# Altium project TemperatureController_2Outputs_v2.0.PrjPcb
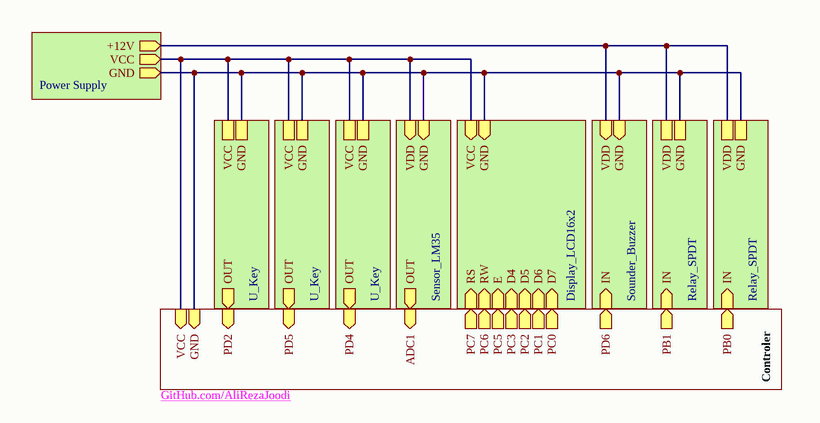
[diagram p0: Main.SchDoc]
14 sheets, 48 parts. Net scope: hierarchical (ports join the sheet entries above them; power ports are global).
Board file: Main.PcbDoc
Sheets:
  Main.SchDoc
    Controler = Controler.SchDoc
      ATmega16 = MCU_ATmega16_DIP.SchDoc
      U_Key = Key_Pull-Up.SchDoc
      U_Oscillator_11 = Oscillator_11.059200MHz.SchDoc
      U_Programer Connectors_SPI = Programer Connectors_SPI.SchDoc
    Display_LCD16x2 = Display_LCD16x2.SchDoc
    Sounder_Buzzer = Sounder_Buzzer.SchDoc
    U_Sensor_LM35 = Sensor_LM35.SchDoc
    U_Power Supply = Power Supply.SchDoc
      U_Power Supply_78xx = Voltage_Regulators_78xx_Figure 1.SchDoc
      U_Power Supply_78xx = Voltage_Regulators_78xx_Figure 1.SchDoc
      U_Voltage_Bridge = Voltage_Bridge.SchDoc
      U_Display_LED_Anode Command = Display_LED_Anode Command.SchDoc
    U_Relay_SPDT = Relay_SPDT.SchDoc
    U_Relay_SPDT = Relay_SPDT.SchDoc
    U_Key = Key_Pull-Up.SchDoc
    U_Key = Key_Pull-Up.SchDoc
    U_Key = Key_Pull-Up.SchDoc

## Sheet Main.SchDoc: Bluetooth Sentinel
size 152 x 76 mm

### Sub-sheets
Controler = Controler.SchDoc: VCC (in), GND (in), PD2 (in), PD5 (in), PD4 (in), PC7 (out), PC6 (out), PC5 (out), PC3 (out), PC2 (out), PC1 (out), PC0 (out), PD6 (out), PB0 (out), PB1 (out), ADC1 (in)
Display_LCD16x2 = Display_LCD16x2: D7 (in), D6 (in), D5 (in), D4 (in), E (in), RW (in), RS (in), GND (in), VCC (in)
Sounder_Buzzer = Sounder_Buzzer: IN (in), GND (in), VDD (in)
U_Key = Key_Pull-Up: OUT (out), GND, VCC
U_Key = Key_Pull-Up: OUT (out), GND, VCC
U_Key = Key_Pull-Up: OUT (out), GND, VCC
U_Power Supply = Power Supply: VCC (out), GND (out), +12V (out)
U_Relay_SPDT = Relay_SPDT: IN (in), GND, VDD
U_Relay_SPDT = Relay_SPDT: IN (in), GND, VDD
U_Sensor_LM35 = Sensor_LM35: VDD (in), OUT (out), GND (in)

### Nets
GND: sheet Controler/GND, sheet Display_LCD16x2/GND, sheet Sounder_Buzzer/GND, sheet U_Sensor_LM35/GND, sheet U_Power Supply/GND, sheet U_Relay_SPDT/GND, sheet U_Relay_SPDT/GND, sheet U_Key/GND, sheet U_Key/GND, sheet U_Key/GND
VCC: sheet Controler/VCC, sheet Display_LCD16x2/VCC, sheet U_Sensor_LM35/VDD, sheet U_Power Supply/VCC, sheet U_Key/VCC, sheet U_Key/VCC, sheet U_Key/VCC
VDD: sheet Sounder_Buzzer/VDD, sheet U_Power Supply/+12V, sheet U_Relay_SPDT/VDD, sheet U_Relay_SPDT/VDD
NetC6_1: sheet Controler/ADC1, sheet U_Sensor_LM35/OUT
NetLCD1_4: sheet Controler/PC7, sheet Display_LCD16x2/RS
NetLCD1_5: sheet Controler/PC6, sheet Display_LCD16x2/RW
NetLCD1_6: sheet Controler/PC5, sheet Display_LCD16x2/E
NetLCD1_11: sheet Controler/PC3, sheet Display_LCD16x2/D4
NetLCD1_12: sheet Controler/PC2, sheet Display_LCD16x2/D5
NetLCD1_13: sheet Controler/PC1, sheet Display_LCD16x2/D6
NetLCD1_14: sheet Controler/PC0, sheet Display_LCD16x2/D7
NetR5_U_Key2_2: sheet Controler/PD2, sheet U_Key/OUT
NetR5_U_Key3_2: sheet Controler/PD5, sheet U_Key/OUT
NetR5_U_Key4_2: sheet Controler/PD4, sheet U_Key/OUT
NetR7_U_Relay_SPDT1_2: sheet Controler/PB1, sheet U_Relay_SPDT/IN
NetR7_U_Relay_SPDT2_2: sheet Controler/PB0, sheet U_Relay_SPDT/IN
NetR8_1: sheet Controler/PD6, sheet Sounder_Buzzer/IN

### Notes on the sheet
- GitHub.com/AliRezaJoodi
- Sheet Title
- Project Title
- Size:
- Date:
- A4
- Item:
- Time:
- Revision:
- Sheet
- of
- File:

## Sheet Controler.SchDoc: Microcontroller STM32F101
size 111 x 101 mm
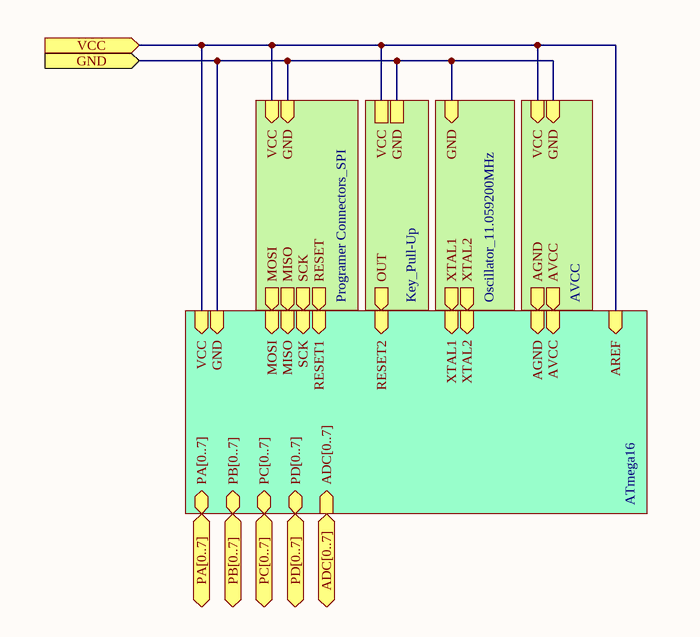
[diagram p1: Controler.SchDoc]

### Sub-sheets
ATmega16 = MCU_ATmega16_DIP.SchDoc: XTAL1 (in), XTAL2 (in), MOSI (in), MISO (in), SCK (in), RESET1 (in), PA[0..7] (bidir), VCC (in), GND (in), PB[0..7], PC[0..7] (bidir), PD[0..7], RESET2 (in), AVCC (in), AREF (in), AGND (in), ADC[0..7] (in)
U_AVCC = AVCC (file not in this document): VCC (in), GND (in), AVCC (out), AGND (out)
U_Key = Key_Pull-Up: OUT (out), GND, VCC
U_Oscillator_11 = Oscillator_11.059200MHz: XTAL1 (out), XTAL2 (out), GND (in)
U_Programer Connectors_SPI = Programer Connectors_SPI: RESET (out), MOSI (out), MISO (out), SCK (out), GND (in), VCC (in)

### Ports
ADC[0..7] (in), GND (in), PA[0..7] (bidir), PB[0..7] (bidir), PC[0..7] (bidir), PD[0..7] (bidir), VCC (in)

### Nets
GND: port GND, sheet ATmega16/GND, sheet U_Key/GND, sheet U_Oscillator_11/GND, sheet U_AVCC/GND, sheet U_Programer Connectors_SPI/GND
VCC: port VCC, sheet ATmega16/VCC, sheet ATmega16/AREF, sheet U_Key/VCC, sheet U_AVCC/VCC, sheet U_Programer Connectors_SPI/VCC
NetC1_2: sheet ATmega16/XTAL1, sheet U_Oscillator_11/XTAL1
NetC2_2: sheet ATmega16/XTAL2, sheet U_Oscillator_11/XTAL2
NetJ1_1: sheet ATmega16/MOSI, sheet U_Programer Connectors_SPI/MOSI
NetJ1_2: sheet ATmega16/MISO, sheet U_Programer Connectors_SPI/MISO
NetJ1_3: sheet ATmega16/SCK, sheet U_Programer Connectors_SPI/SCK
NetJ1_4: sheet ATmega16/RESET1, sheet ATmega16/RESET2, sheet U_Key/OUT, sheet U_Programer Connectors_SPI/RESET
NetU1_30: sheet ATmega16/AVCC, sheet U_AVCC/AVCC
NetU1_31: sheet ATmega16/AGND, sheet U_AVCC/AGND

### Buses and harness runs
bus port ADC[0..7] = sheet ATmega16/ADC[0..7]
bus port PA[0..7] = sheet ATmega16/PA[0..7]
bus port PB[0..7] = sheet ATmega16/PB[0..7]
bus port PC[0..7] = sheet ATmega16/PC[0..7]
bus port PD[0..7] = sheet ATmega16/PD[0..7]

### Notes on the sheet
- Sheet Title
- Project Title
- Size:
- Date:
- A4
- Item:
- Time:
- Revision:
- Sheet
- of
- File:

## Sheet MCU_ATmega16_DIP.SchDoc
size 127 x 88 mm
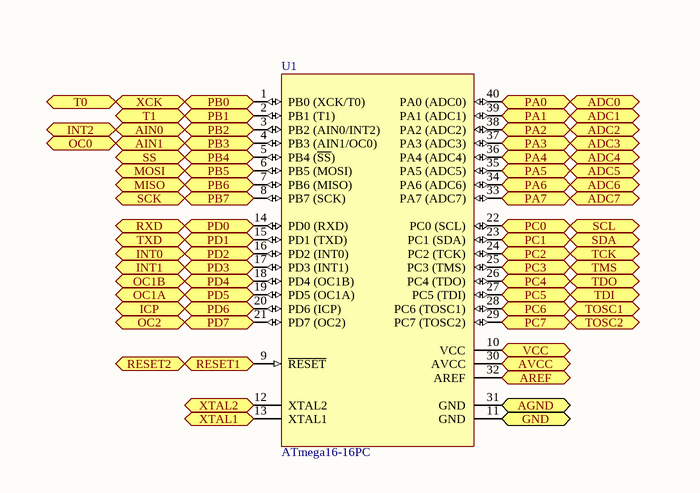
[diagram p2: MCU_ATmega16_DIP.SchDoc]

### Parts
U1  ATmega16-16PC  [40P6]

### Ports
ADC0 (bidir), ADC1 (bidir), ADC2 (bidir), ADC3 (bidir), ADC4 (bidir), ADC5 (bidir), ADC6 (bidir), ADC7 (bidir), AGND, AIN0 (bidir), AIN1 (bidir), AREF, AVCC, GND, ICP (bidir), INT0 (bidir), INT1 (bidir), INT2 (bidir), MISO (bidir), MOSI (bidir), OC0 (bidir), OC1A (bidir), OC1B (bidir), OC2 (bidir), PA0 (bidir), PA1 (bidir), PA2 (bidir), PA3 (bidir), PA4 (bidir), PA5 (bidir), PA6 (bidir), PA7 (bidir), PB0, PB1, PB2, PB3, PB4, PB5, PB6, PB7, PC0 (bidir), PC1 (bidir), PC2 (bidir), PC3 (bidir), PC4 (bidir), PC5 (bidir), PC6 (bidir), PC7 (bidir), PD0, PD1, PD2, PD3, PD4, PD5, PD6, PD7, RESET1 (in), RESET2 (in), RXD (bidir), SCK (bidir), SCL (bidir), SDA (bidir), SS (bidir), T0 (bidir), T1 (bidir), TCK (bidir), TDI (bidir), TDO (bidir), TMS (bidir), TOSC1 (bidir), TOSC2 (bidir), TXD (bidir), VCC, XCK (bidir), XTAL1 (bidir), XTAL2 (bidir)

### Nets
GND: U1.11(GND) ; port GND
VCC: U1.10(VCC) U1.32(AREF) ; port VCC, port AREF
NetC1_2: U1.13(XTAL1) ; port XTAL1
NetC2_2: U1.12(XTAL2) ; port XTAL2
NetJ1_1: U1.6(PB5_(MOSI)) ; port PB5, port MOSI
NetJ1_2: U1.7(PB6_(MISO)) ; port MISO, port PB6
NetJ1_3: U1.8(PB7_(SCK)) ; port SCK, port PB7
NetJ1_4: U1.9(~{RESET}) ; port RESET1, port RESET2
NetU1_1: U1.1(PB0_(XCK/T0)) ; port XCK, port PB0, port T0
NetU1_2: U1.2(PB1_(T1)) ; port T1, port PB1
NetU1_3: U1.3(PB2_(AIN0/INT2)) ; port PB2, port AIN0, port INT2
NetU1_4: U1.4(PB3_(AIN1/OC0)) ; port AIN1, port PB3, port OC0
NetU1_5: U1.5(PB4_(~{SS})) ; port SS, port PB4
NetU1_14: U1.14(PD0_(RXD)) ; port RXD, port PD0
NetU1_15: U1.15(PD1_(TXD)) ; port TXD, port PD1
NetU1_16: U1.16(PD2_(INT0)) ; port PD2, port INT0
NetU1_17: U1.17(PD3_(INT1)) ; port INT1, port PD3
NetU1_18: U1.18(PD4_(OC1B)) ; port OC1B, port PD4
NetU1_19: U1.19(PD5_(OC1A)) ; port PD5, port OC1A
NetU1_20: U1.20(PD6_(ICP)) ; port ICP, port PD6
NetU1_21: U1.21(PD7_(OC2)) ; port OC2, port PD7
NetU1_22: U1.22(PC0_(SCL)) ; port PC0, port SCL
NetU1_23: U1.23(PC1_(SDA)) ; port PC1, port SDA
NetU1_24: U1.24(PC2_(TCK)) ; port PC2, port TCK
NetU1_25: U1.25(PC3_(TMS)) ; port PC3, port TMS
NetU1_26: U1.26(PC4_(TDO)) ; port PC4, port TDO
NetU1_27: U1.27(PC5_(TDI)) ; port PC5, port TDI
NetU1_28: U1.28(PC6_(TOSC1)) ; port PC6, port TOSC1
NetU1_29: U1.29(PC7_(TOSC2)) ; port PC7, port TOSC2
NetU1_30: U1.30(AVCC) ; port AVCC
NetU1_31: U1.31(GND) ; port AGND
NetU1_33: U1.33(PA7_(ADC7)) ; port PA7, port ADC7
NetU1_34: U1.34(PA6_(ADC6)) ; port PA6, port ADC6
NetU1_35: U1.35(PA5_(ADC5)) ; port PA5, port ADC5
NetU1_36: U1.36(PA4_(ADC4)) ; port PA4, port ADC4
NetU1_37: U1.37(PA3_(ADC3)) ; port PA3, port ADC3
NetU1_38: U1.38(PA2_(ADC2)) ; port PA2, port ADC2
NetU1_39: U1.39(PA1_(ADC1)) ; port PA1, port ADC1
NetU1_40: U1.40(PA0_(ADC0)) ; port PA0, port ADC0

### Library data of the parts
U1 = ATmega16-16PC: 8-Bit AVR Microcontroller with 16K Bytes of In-System Programmable Flash Memory; Published: 17-Sep-2003; DatasheetVersion: 2466E-AVR-10/02; PackageVersion: revB, Sep-2001; PackageReference: 40P6; Publisher: Altium Limited; PackageDescription: 40-lead (0.600"/15.24mm Wide) Plastic Dual Inline Package (PDIP); Supplier 1: Digi-Key; Supplier Part Number 1: ATMEGA16-16PC-ND; Supplier 2: Mouser; Supplier Part Number 2: 556-ATMEGA16-16PC; Code_JEDEC: MS-011-AC; ComponentLink1Description: Datasheet; ComponentLink1URL: http://www.atmel.com/dyn/resources/prod_documents/doc2466.pdf; ComponentLink2Description: Atmel.com Home; ComponentLink2URL: http://www.atmel.com

## Sheet Key_Pull-Up.SchDoc
size 76 x 55 mm
Used 4 times, as channels Controler/U_Key, U_Key, U_Key, U_Key. Parts and nets are listed once, with the designators drawn on the sheet.
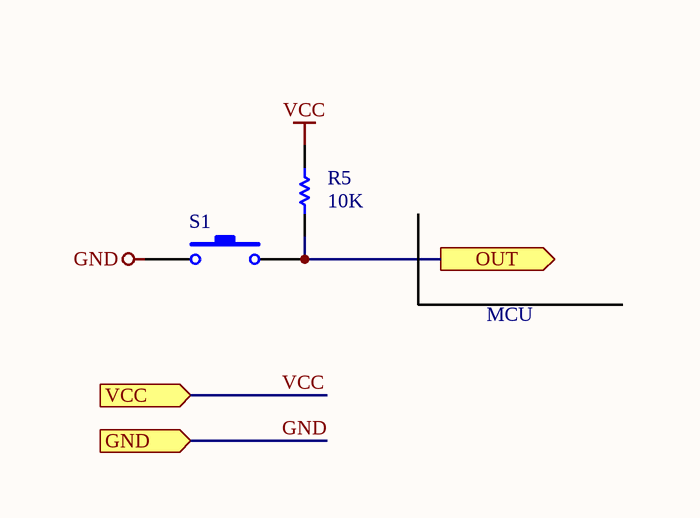
[diagram p3: Key_Pull-Up.SchDoc]

### Parts
R5  value 10K  [AXIAL-0.4]  (hidden comment: Res1)
S1  SW-PB  [SPST-2_2]  (value not drawn)

### Ports
GND, OUT (out), VCC

### Nets
GND: S1.1 ; port GND
VCC: R5.1 ; port VCC
OUT: R5.2 S1.2 ; port OUT

### Channels
Controler/U_Key: designators end in _U_Key1; ports GND=GND OUT=NetJ1_4 VCC=VCC
U_Key: designators end in _U_Key2; ports GND=GND OUT=NetR5_U_Key2_2 VCC=VCC
U_Key: designators end in _U_Key3; ports GND=GND OUT=NetR5_U_Key3_2 VCC=VCC
U_Key: designators end in _U_Key4; ports GND=GND OUT=NetR5_U_Key4_2 VCC=VCC

### Notes on the sheet
- MCU

### Library data of the parts
R5 = Res1: Resistor; Manufacturer: Generic Components; Class I: Passive; Published: 8-Jun-2000; Revision: July-2002: Re-released for DXP Platform.; Publisher: Altium Limited; Class II: Resistor
S1 = SW-PB: Switch; Manufacturer: Generic Components; Published: 24-Mar-1999; Revision: July-2002: Re-released for DXP Platform.; Publisher: Altium Limited

## Sheet Oscillator_11.059200MHz.SchDoc
size 81 x 45 mm
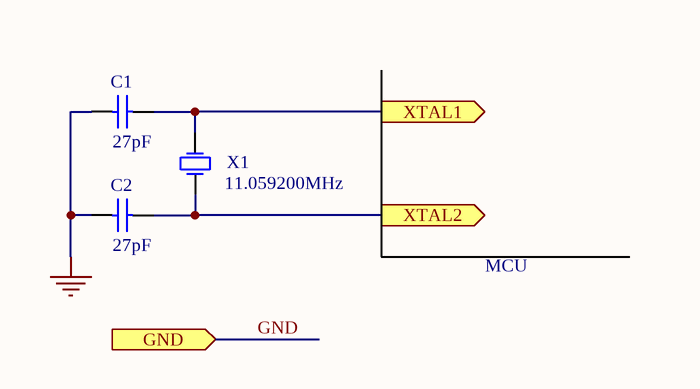
[diagram p4: Oscillator_11.059200MHz.SchDoc]

### Parts
C1  value 27pF  [CAPNTO2.54-3.56x2.03]  (hidden comment: Cap)
C2  value 27pF  [CAPNTO2.54-3.56x2.03]  (hidden comment: Cap)
X1  value 11.059200MHz  [XTAL_1]  (hidden comment: XTAL)

### Ports
GND (in), XTAL1 (out), XTAL2 (out)

### Nets
GND: C1.1 C2.1 ; port GND
NetC1_2: C1.2 X1.2(OSC2) ; port XTAL1
NetC2_2: C2.2 X1.1(OSC1) ; port XTAL2

### Notes on the sheet
- MCU

### Library data of the parts
C1 C2 = Cap: Capacitor; Manufacturer: Generic Components; Class I: Passive; Published: 8-Jun-2000; Revision: July-2002: Re-released for DXP Platform.; Publisher: Altium Limited; Class II: Capacitor
X1 = XTAL: Crystal Oscillator; Manufacturer: Generic Components; Published: 8-Jun-2000; Revision: July-2002: Re-released for DXP Platform.; Publisher: Altium Limited; Class I: Oscillator; Class II: Crystal Oscillator

## Sheet Programer Connectors_SPI.SchDoc
size 50 x 30 mm
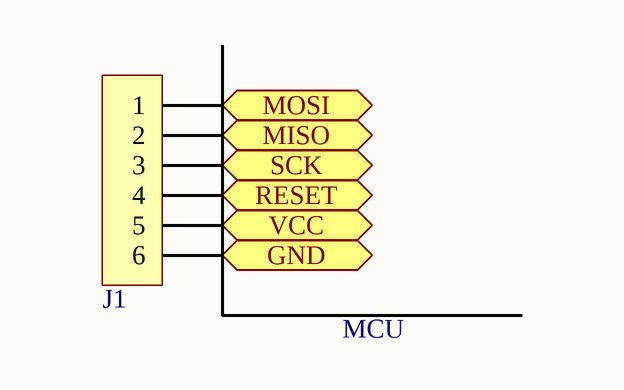
[diagram p5: Programer Connectors_SPI.SchDoc]

### Parts
J1  Connector_6pin  [HDR1X6]  (value not drawn)

### Ports
GND (in), MISO (out), MOSI (out), RESET (out), SCK (out), VCC (in)

### Nets
GND: J1.6 ; port GND
VCC: J1.5 ; port VCC
NetJ1_1: J1.1 ; port MOSI
NetJ1_2: J1.2 ; port MISO
NetJ1_3: J1.3 ; port SCK
NetJ1_4: J1.4 ; port RESET

### Notes on the sheet
- MCU

### Library data of the parts
J1 = Connector_6pin: Header, 6-Pin; Manufacturer: Generic Components; Revision: July-2002: Re-released for DXP Platform.; Publisher: Altium Limited; Class I: Connector

## Sheet Display_LCD16x2.SchDoc
size 116 x 109 mm
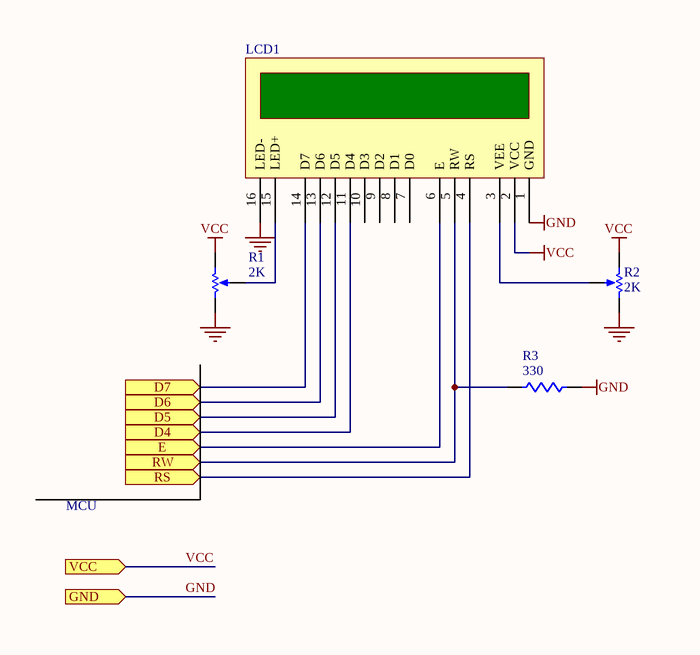
[diagram p6: Display_LCD16x2.SchDoc]

### Parts
LCD1  LCD_16*2  [LCD_2x16]  (value not drawn)
R1  value 2K  [VR8-5/5.6MM]  (hidden comment: RPot1)
R2  value 2K  [VR8-5/5.6MM]  (hidden comment: RPot1)
R3  value 330  [AXIAL-0.4]  (hidden comment: Res1)

### Ports
D4 (in), D5 (in), D6 (in), D7 (in), E (in), GND, RS (in), RW (in), VCC

### Nets
GND: LCD1.1(GND) LCD1.16(LED-) R1.2(BOT) R2.1(TOP) R3.1 ; port GND
VCC: LCD1.2(VCC) R1.1(TOP) R2.2(BOT) ; port VCC
NetLCD1_3: LCD1.3(VEE) R2.3(TAP)
NetLCD1_4: LCD1.4(RS) ; port RS
NetLCD1_5: LCD1.5(RW) R3.2 ; port RW
NetLCD1_6: LCD1.6(E) ; port E
NetLCD1_11: LCD1.11(D4) ; port D4
NetLCD1_12: LCD1.12(D5) ; port D5
NetLCD1_13: LCD1.13(D6) ; port D6
NetLCD1_14: LCD1.14(D7) ; port D7
NetLCD1_15: LCD1.15(LED+) R1.3(TAP)

Not connected (* = marked no-connect by the designer): LCD1 7(D0) 8(D1) 9(D2) 10(D3)

### Notes on the sheet
- MCU

### Library data of the parts
R1 R2 = RPot1: Potentiometer; Manufacturer: Generic Components; Class I: Passive; Set Position: 0.5; Published: 8-Jun-2000; Revision: July-2002: Re-released for DXP Platform.; Publisher: Altium Limited; Class II: Potentiometer
R3 = Res1: as R5 on sheet Key_Pull-Up; Published: 8-Jun-2000; Revision: July-2002: Re-released for DXP Platform.; Publisher: Altium Limited; Class II: Resistor

## Sheet Sounder_Buzzer.SchDoc
size 87 x 67 mm
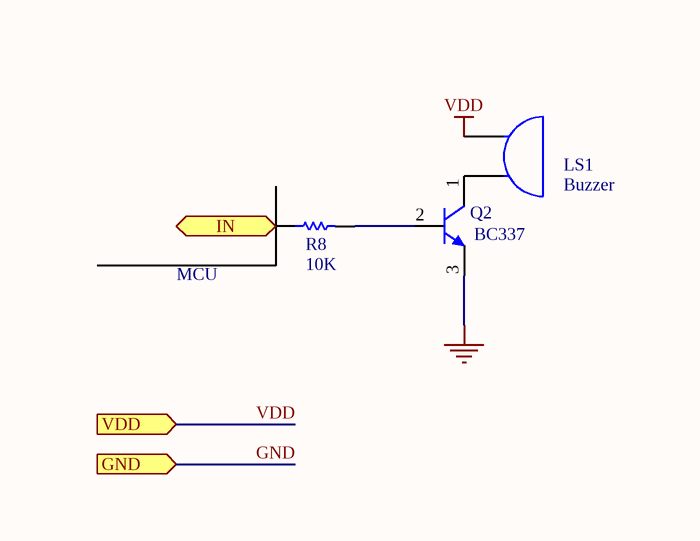
[diagram p7: Sounder_Buzzer.SchDoc]

### Parts
LS1  Buzzer  [BUZZER]
Q2  value BC337  [TO92C]  (hidden comment: NPN)
R8  value 10K  [AXIAL-0.4]  (hidden comment: Res1)

### Ports
GND, IN (in), VDD

### Nets
GND: Q2.3(E) ; port GND
VDD: LS1.1(A) ; port VDD
NetLS1_2: LS1.2(B) Q2.1(C)
NetQ2_2: Q2.2(B) R8.2
NetR8_1: R8.1 ; port IN

### Notes on the sheet
- MCU

### Library data of the parts
LS1 = Buzzer: Manufacturer: Generic Components; Published: 24-Mar-1999; Revision: July-2002: Re-released for DXP Platform.; Publisher: Altium Limited
Q2 = NPN: NPN Bipolar Transistor; Manufacturer: Generic Components; Class I: Discrete; Class II: BJT - Low Power; Published: 8-Jun-2000; Revision: July-2002: Re-released for DXP Platform.; Publisher: Altium Limited
R8 = Res1: as R5 on sheet Key_Pull-Up; Published: 8-Jun-2000; Revision: July-2002: Re-released for DXP Platform.; Publisher: Altium Limited; Class II: Resistor

## Sheet Sensor_LM35.SchDoc
size 101 x 45 mm
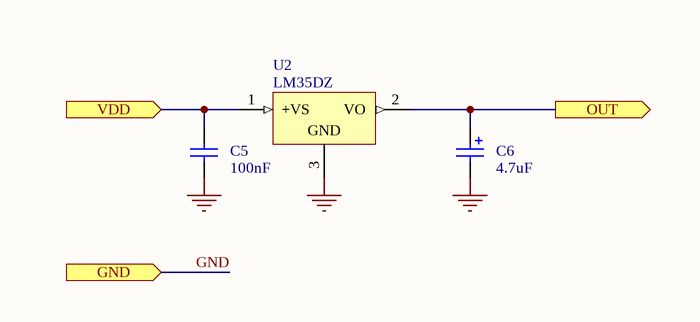
[diagram p8: Sensor_LM35.SchDoc]

### Parts
C5  value 100nF  [CAPNTO5.08-7.37x3.94]  (hidden comment: Cap)
C6  value 4.7uF  [CAPPR2.5-6.3x5]  (hidden comment: Cap Pol1)
U2  LM35DZ  [TO92C]

### Ports
GND (in), OUT (out), VDD (in)

### Nets
GND: C5.1 C6.2 U2.3(GND) ; port GND
VCC: C5.2 U2.1(+VS) ; port VDD
NetC6_1: C6.1 U2.2(VO) ; port OUT

### Library data of the parts
C5 = Cap: as C1 on sheet Oscillator_11.059200MHz; Published: 8-Jun-2000; Revision: July-2002: Re-released for DXP Platform.; Publisher: Altium Limited; Class II: Capacitor
C6 = Cap Pol1: Polarized Capacitor (Radial); Manufacturer: Generic Components; Class I: Passive; Published: 8-Jun-2000; Revision: July-2002: Re-released for DXP Platform.; Publisher: Altium Limited; Class II: Capacitor
U2 = LM35DZ: Precision Centigrade Temperature Sensor, 3-pin TO-92; Manufacturer: National Semiconductor; PackageTopMarking: NSXYTT*LM35*DZ; PowerWise: N; CompType: Temp Sensor IC; Published: 4-Dec-2008; LatestRevisionDate: 15-Jul-2009; LatestRevisionNote: Sch pins 1 & 3 reversed.; DatasheetVersion: Nov-2000; PackageVersion: revG, Sep-2000; PackageReference: Z03A; Publisher: Altium Limited; PackageDescription: TO-92, Molded, 3 Lead; Supplier 1: Farnell; Supplier Part Number 1: 9488200; PartNumber: LM35DZ; RoHS: N; PinCount: 3; Code_JEDEC: TO-226-AA; ComponentLink1Description: LM35 Datasheet; ComponentLink1URL: http://www.national.com/ds/LM/LM35.pdf; ComponentLink2Description: LM35 Web Page; ComponentLink2URL: http://www.national.com/pf/LM/LM35.html; ComponentLink3Description: Z03A Package Page; ComponentLink3URL: http://www.national.com/packaging/folders/z03a.html

## Sheet Power Supply.SchDoc
size 152 x 39 mm
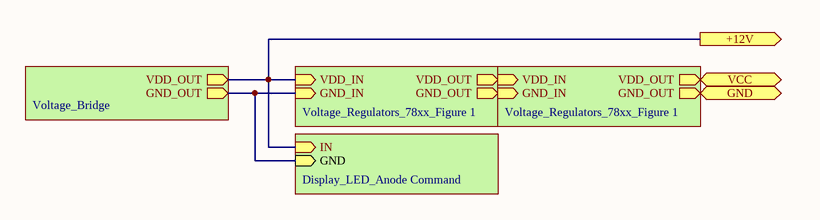
[diagram p9: Power Supply.SchDoc]

### Sub-sheets
U_Display_LED_Anode Command = Display_LED_Anode Command: GND (in), IN (in)
U_Power Supply_78xx = Voltage_Regulators_78xx_Figure 1: VDD_OUT (out), GND_IN (in), VDD_IN (in), GND_OUT (out)
U_Power Supply_78xx = Voltage_Regulators_78xx_Figure 1: VDD_OUT (out), GND_IN (in), VDD_IN (in), GND_OUT (out)
U_Voltage_Bridge = Voltage_Bridge: VDD_OUT (out), GND_OUT (out)

### Ports
+12V (out), GND (out), VCC (out)

### Nets
GND: port GND, sheet U_Power Supply_78xx/GND_IN, sheet U_Power Supply_78xx/GND_OUT, sheet U_Power Supply_78xx/GND_IN, sheet U_Power Supply_78xx/GND_OUT, sheet U_Voltage_Bridge/GND_OUT, sheet U_Display_LED_Anode Command/GND
VCC: port VCC, sheet U_Power Supply_78xx/VDD_OUT
VDD: port +12V, sheet U_Power Supply_78xx/VDD_IN, sheet U_Voltage_Bridge/VDD_OUT, sheet U_Display_LED_Anode Command/IN
NetC3_U_Power_Supply_78xx1_1: sheet U_Power Supply_78xx/VDD_OUT, sheet U_Power Supply_78xx/VDD_IN

## Sheet Voltage_Regulators_78xx_Figure 1.SchDoc
size 96 x 43 mm
Used 2 times, as channels U_Power Supply/U_Power Supply_78xx, U_Power Supply/U_Power Supply_78xx. Parts and nets are listed once, with the designators drawn on the sheet.
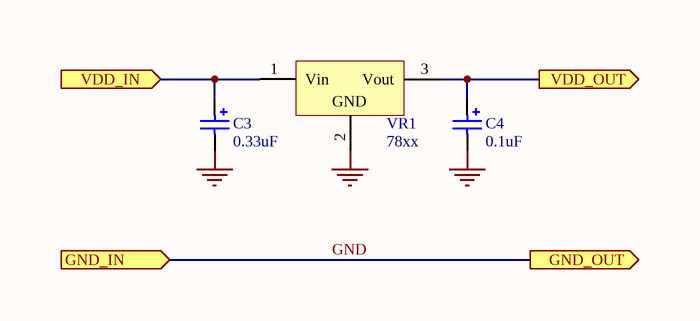
[diagram p10: Voltage_Regulators_78xx_Figure 1.SchDoc]

### Parts
C3  value 0.33uF  [CAPPR2.5-6.3x5]  (hidden comment: Cap Pol1)
C4  value 0.1uF  [CAPPR2.5-6.3x5]  (hidden comment: Cap Pol1)
VR1  value 78xx  [TO257H]  (hidden comment: Volt Reg)

### Ports
GND_IN (in), GND_OUT (out), VDD_IN (in), VDD_OUT (out)

### Nets
GND: C3.2 C4.2 VR1.2(GND) ; port GND_IN, port GND_OUT
VDD_IN: C3.1 VR1.1(Vin) ; port VDD_IN
VDD_OUT: C4.1 VR1.3(Vout) ; port VDD_OUT

### Channels
U_Power Supply/U_Power Supply_78xx: designators end in _U_Power_Supply_78xx2; ports GND_IN=GND GND_OUT=GND VDD_IN=VDD VDD_OUT=NetC3_U_Power_Supply_78xx1_1
U_Power Supply/U_Power Supply_78xx: designators end in _U_Power_Supply_78xx1; ports GND_IN=GND GND_OUT=GND VDD_IN=NetC3_U_Power_Supply_78xx1_1 VDD_OUT=VCC

### Library data of the parts
C3 C4 = Cap Pol1: as C6 on sheet Sensor_LM35; Published: 8-Jun-2000; Revision: July-2002: Re-released for DXP Platform.; Publisher: Altium Limited; Class II: Capacitor
VR1 = Volt Reg: Voltage Regulator; Manufacturer: Generic Components; Class I: Power Management; Published: 24-Mar-1999; Revision: July-2002: Re-released for DXP Platform.; Publisher: Altium Limited; Class II: Voltage Regulator

## Sheet Voltage_Bridge.SchDoc
size 99 x 48 mm
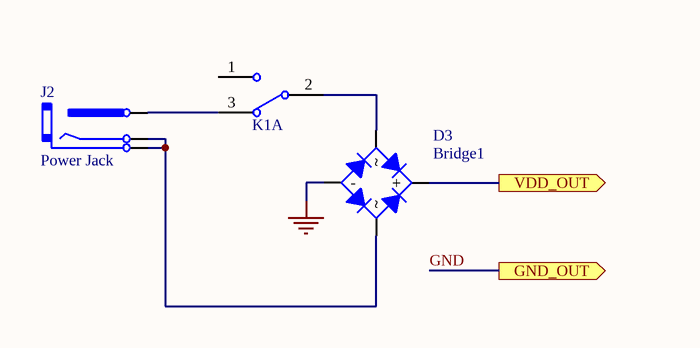
[diagram p11: Voltage_Bridge.SchDoc]

### Parts
D3  Bridge1  [BRIDGE-2]
J2  Power Jack  [KLD-0202]
K1  SW DPDT_2  [DPDT-6_2]  (value not drawn)  (part A of 2)

### Ports
GND_OUT (out), VDD_OUT (out)

### Nets
GND: D3.1(-) ; port GND_OUT
VDD: D3.3(+) ; port VDD_OUT
NetD3_2: D3.2 K1.2(COMMON)
NetD3_4: D3.4 J2.2(A) J2.3(B)
NetJ2_1: J2.1(A) K1.3(NC)

Not connected (* = marked no-connect by the designer): K1 1(NO)

### Library data of the parts
D3 = Bridge1: Full Wave Diode Bridge; Manufacturer: Generic Components; Class I: Discrete; Class II: Rectifier - Bridge; Published: 8-Jun-2000; Revision: July-2002: Re-released for DXP Platform.; Publisher: Altium Limited
K1 = SW DPDT_2: Single-Pole, Double-Throw Switch, Key; Manufacturer: Generic Components; Published: 24-Mar-1999; Revision: July-2002: Re-released for DXP Platform.; Publisher: Altium Limited

## Sheet Display_LED_Anode Command.SchDoc: Red LED
size 60 x 33 mm
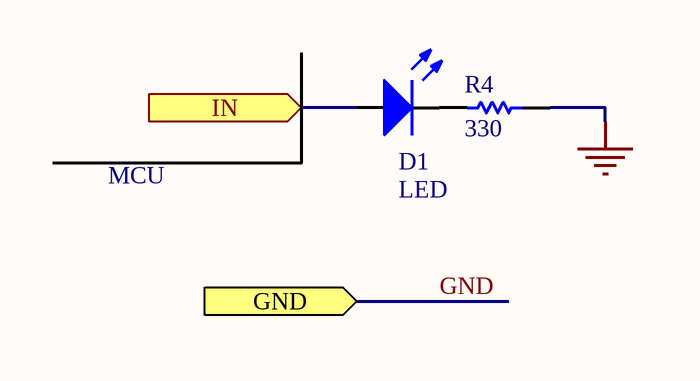
[diagram p12: Display_LED_Anode Command.SchDoc]

### Parts
D1  LED  [LED-5mm_Red]
R4  value 330  [AXIAL-0.4]  (hidden comment: Res1)

### Ports
GND (in), IN (in)

### Nets
GND: R4.1 ; port GND
VDD: D1.1(A) ; port IN
NetD1_2: D1.2(K) R4.2

### Notes on the sheet
- MCU
- Sheet Title
- Project Title
- Size:
- Date:
- A4
- Item:
- Time:
- Revision:
- Sheet
- of
- File:

### Library data of the parts
D1 = LED: Typical INFRARED GaAs LED; Manufacturer: Generic Components; Class I: Optoelectronic; Published: 8-Jun-2000; Revision: July-2002: Re-released for DXP Platform.; Publisher: Altium Limited; Class II: LED
R4 = Res1: as R5 on sheet Key_Pull-Up; Published: 8-Jun-2000; Revision: July-2002: Re-released for DXP Platform.; Publisher: Altium Limited; Class II: Resistor

## Sheet Relay_SPDT.SchDoc
size 106 x 88 mm
Used 2 times, as channels U_Relay_SPDT, U_Relay_SPDT. Parts and nets are listed once, with the designators drawn on the sheet.
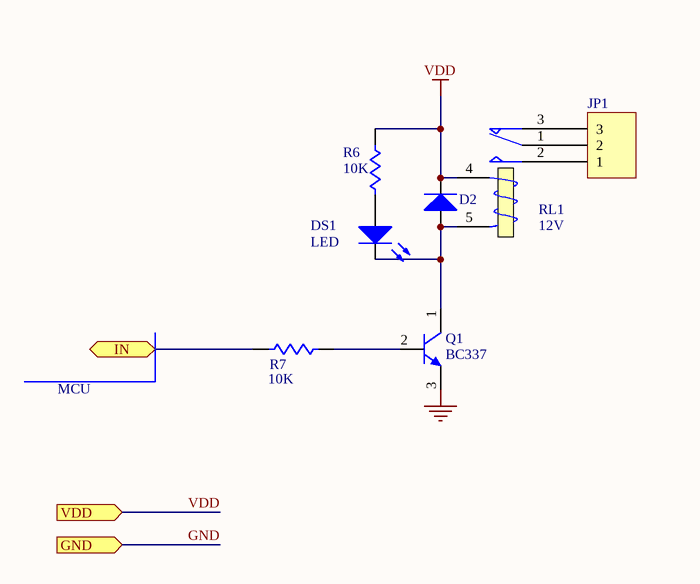
[diagram p13: Relay_SPDT.SchDoc]

### Parts
D2  Diode  [DIODE-0.4]  (value not drawn)
DS1  LED  [LED-5mm_Red]
JP1  Header 3  [Fonics_3C]  (value not drawn)
Q1  BC337  [TO92C]
R6  value 10K  [AXIAL-0.4]  (hidden comment: Res1)
R7  value 10K  [AXIAL-0.4]  (hidden comment: Res1)
RL1  value 12V  [RELAY-SPDT-1]  (hidden comment: Relay-SPDT_2)

### Ports
GND, IN, VDD

### Nets
GND: Q1.3(E) ; port GND
VDD: D2.2(K) R6.1 RL1.4(T1) ; port VDD
IN: R7.2 ; port IN
NetD2_1: D2.1(A) DS1.2(K) Q1.1(C) RL1.5(T2)
NetDS1_1: DS1.1(A) R6.2
NetJP1_1: JP1.1 RL1.2(NO)
NetJP1_2: JP1.2 RL1.1(COM)
NetJP1_3: JP1.3 RL1.3(NC)
NetQ1_2: Q1.2(B) R7.1

### Channels
U_Relay_SPDT: designators end in _U_Relay_SPDT1; ports GND=GND IN=NetR7_U_Relay_SPDT1_2 VDD=VDD
U_Relay_SPDT: designators end in _U_Relay_SPDT2; ports GND=GND IN=NetR7_U_Relay_SPDT2_2 VDD=VDD

### Notes on the sheet
- MCU

### Library data of the parts
D2 = Diode: Default Diode; Manufacturer: Generic Components; Class I: Discrete; Class II: Diode - Switching; Published: 8-Jun-2000; Revision: July-2002: Re-released for DXP Platform.; Publisher: Altium Limited
DS1 = LED: as D1 on sheet Display_LED_Anode Command; Published: 8-Jun-2000; Revision: July-2002: Re-released for DXP Platform.; Publisher: Altium Limited; Class II: LED
JP1 = Header 3: Header, 3-Pin; Manufacturer: Generic Components; Class I: Connector; Revision: July-2002: Re-released for DXP Platform.; Publisher: Altium Limited
Q1 = NPN: as Q2 on sheet Sounder_Buzzer; Published: 8-Jun-2000; Revision: July-2002: Re-released for DXP Platform.; Publisher: Altium Limited
R6 R7 = Res1: as R5 on sheet Key_Pull-Up; Published: 8-Jun-2000; Revision: July-2002: Re-released for DXP Platform.; Publisher: Altium Limited; Class II: Resistor
RL1 = Relay-SPDT_2: SPDT Relay; Manufacturer: Generic Components; Class I: Electro-mechanical; Published: 8-Jun-2000; Revision: July-2002: Re-released for DXP Platform.; Publisher: Altium Limited; Class II: Relay

## Nets that join several sheets
GND: MCU_ATmega16_DIP (U1.11), Controler/U_Key (S1_U_Key1.1), Oscillator_11.059200MHz (C1.1 C2.1), Programer Connectors_SPI (J1.6), Display_LCD16x2 (5 pins), Sounder_Buzzer (Q2.3), Sensor_LM35 (C5.1 C6.2 U2.3), U_Power Supply/U_Power Supply_78xx (C3_U_Power_Supply_78xx2.2 C4_U_Power_Supply_78xx2.2 VR1_U_Power_Supply_78xx2.2), U_Power Supply/U_Power Supply_78xx (C3_U_Power_Supply_78xx1.2 C4_U_Power_Supply_78xx1.2 VR1_U_Power_Supply_78xx1.2), Voltage_Bridge (D3.1), Display_LED_Anode Command (R4.1), U_Relay_SPDT (Q1_U_Relay_SPDT1.3), U_Relay_SPDT (Q1_U_Relay_SPDT2.3), U_Key (S1_U_Key2.1), U_Key (S1_U_Key3.1), U_Key (S1_U_Key4.1)
VCC: MCU_ATmega16_DIP (U1.10 U1.32), Controler/U_Key (R5_U_Key1.1), Programer Connectors_SPI (J1.5), Display_LCD16x2 (LCD1.2 R1.1 R2.2), Sensor_LM35 (C5.2 U2.1), U_Power Supply/U_Power Supply_78xx (C4_U_Power_Supply_78xx1.1 VR1_U_Power_Supply_78xx1.3), U_Key (R5_U_Key2.1), U_Key (R5_U_Key3.1), U_Key (R5_U_Key4.1)
VDD: Sounder_Buzzer (LS1.1), U_Power Supply/U_Power Supply_78xx (C3_U_Power_Supply_78xx2.1 VR1_U_Power_Supply_78xx2.1), Voltage_Bridge (D3.3), Display_LED_Anode Command (D1.1), U_Relay_SPDT (D2_U_Relay_SPDT1.2 R6_U_Relay_SPDT1.1 RL1_U_Relay_SPDT1.4), U_Relay_SPDT (D2_U_Relay_SPDT2.2 R6_U_Relay_SPDT2.1 RL1_U_Relay_SPDT2.4)
NetC1_2: MCU_ATmega16_DIP (U1.13), Oscillator_11.059200MHz (C1.2 X1.2)
NetC2_2: MCU_ATmega16_DIP (U1.12), Oscillator_11.059200MHz (C2.2 X1.1)
NetC3_U_Power_Supply_78xx1_1: U_Power Supply/U_Power Supply_78xx (C4_U_Power_Supply_78xx2.1 VR1_U_Power_Supply_78xx2.3), U_Power Supply/U_Power Supply_78xx (C3_U_Power_Supply_78xx1.1 VR1_U_Power_Supply_78xx1.1)
NetJ1_1: MCU_ATmega16_DIP (U1.6), Programer Connectors_SPI (J1.1)
NetJ1_2: MCU_ATmega16_DIP (U1.7), Programer Connectors_SPI (J1.2)
NetJ1_3: MCU_ATmega16_DIP (U1.8), Programer Connectors_SPI (J1.3)
NetJ1_4: MCU_ATmega16_DIP (U1.9), Controler/U_Key (R5_U_Key1.2 S1_U_Key1.2), Programer Connectors_SPI (J1.4)